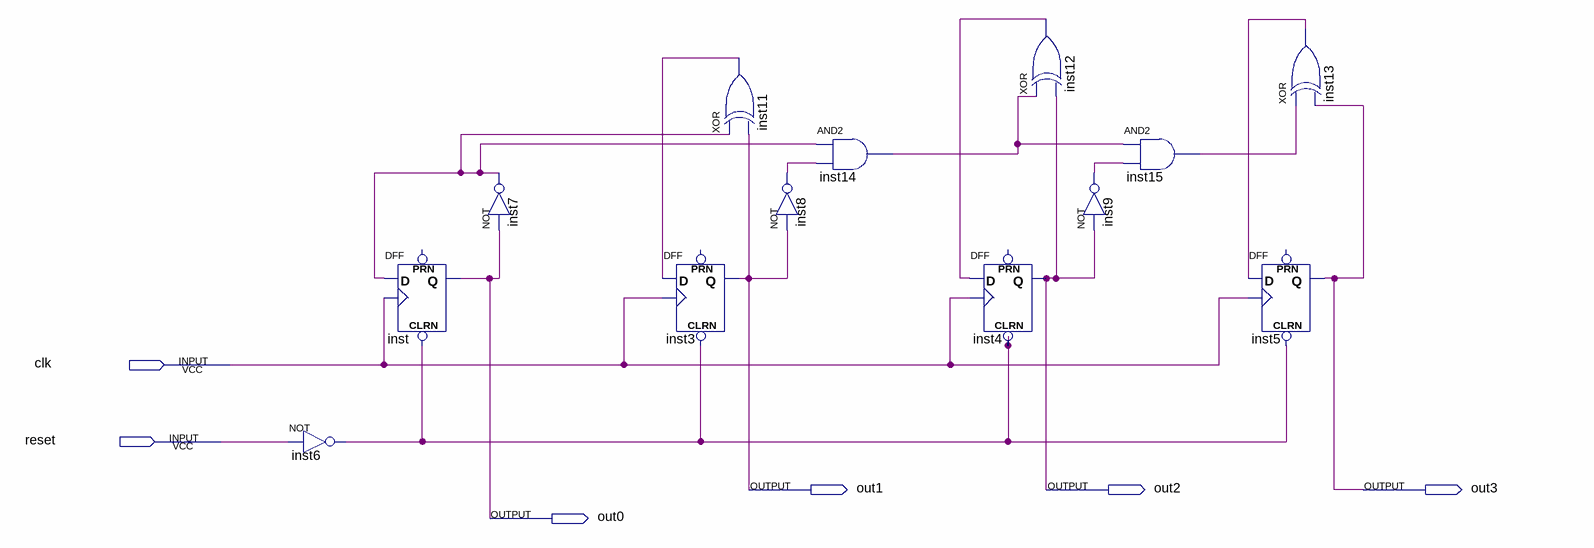
[diagram p0: schematic sheet]
// Quartus schematic SchemCounter.bdf as structural Verilog: 13 symbols, 6 pins
module SchemCounter (
  input  clk,
  input  reset,
  output out1,
  output out2,
  output out3,
  output out0
);

  wire inst6_out, inst7_out, inst8_out, inst9_out, inst11_out, inst12_out, inst13_out, inst14_out, inst15_out;

  not inst6 (inst6_out, reset);
  DFF inst (.CLRN(inst6_out), .CLK(clk), .D(inst7_out), .Q(out0));  // open: PRN
  not inst7 (inst7_out, out0);
  DFF inst3 (.CLRN(inst6_out), .CLK(clk), .D(inst11_out), .Q(out1));  // open: PRN
  xor inst11 (inst11_out, inst7_out, out1);
  and inst14 (inst14_out, inst7_out, inst8_out);
  not inst8 (inst8_out, out1);
  DFF inst4 (.CLRN(inst6_out), .CLK(clk), .D(inst12_out), .Q(out2));  // open: PRN
  xor inst12 (inst12_out, inst14_out, out2);
  and inst15 (inst15_out, inst14_out, inst9_out);
  not inst9 (inst9_out, out2);
  xor inst13 (inst13_out, inst15_out, out3);
  DFF inst5 (.CLRN(inst6_out), .CLK(clk), .D(inst13_out), .Q(out3));  // open: PRN
endmodule
